# EAGLE design ARDUINO (EAGLE 9.6.2)
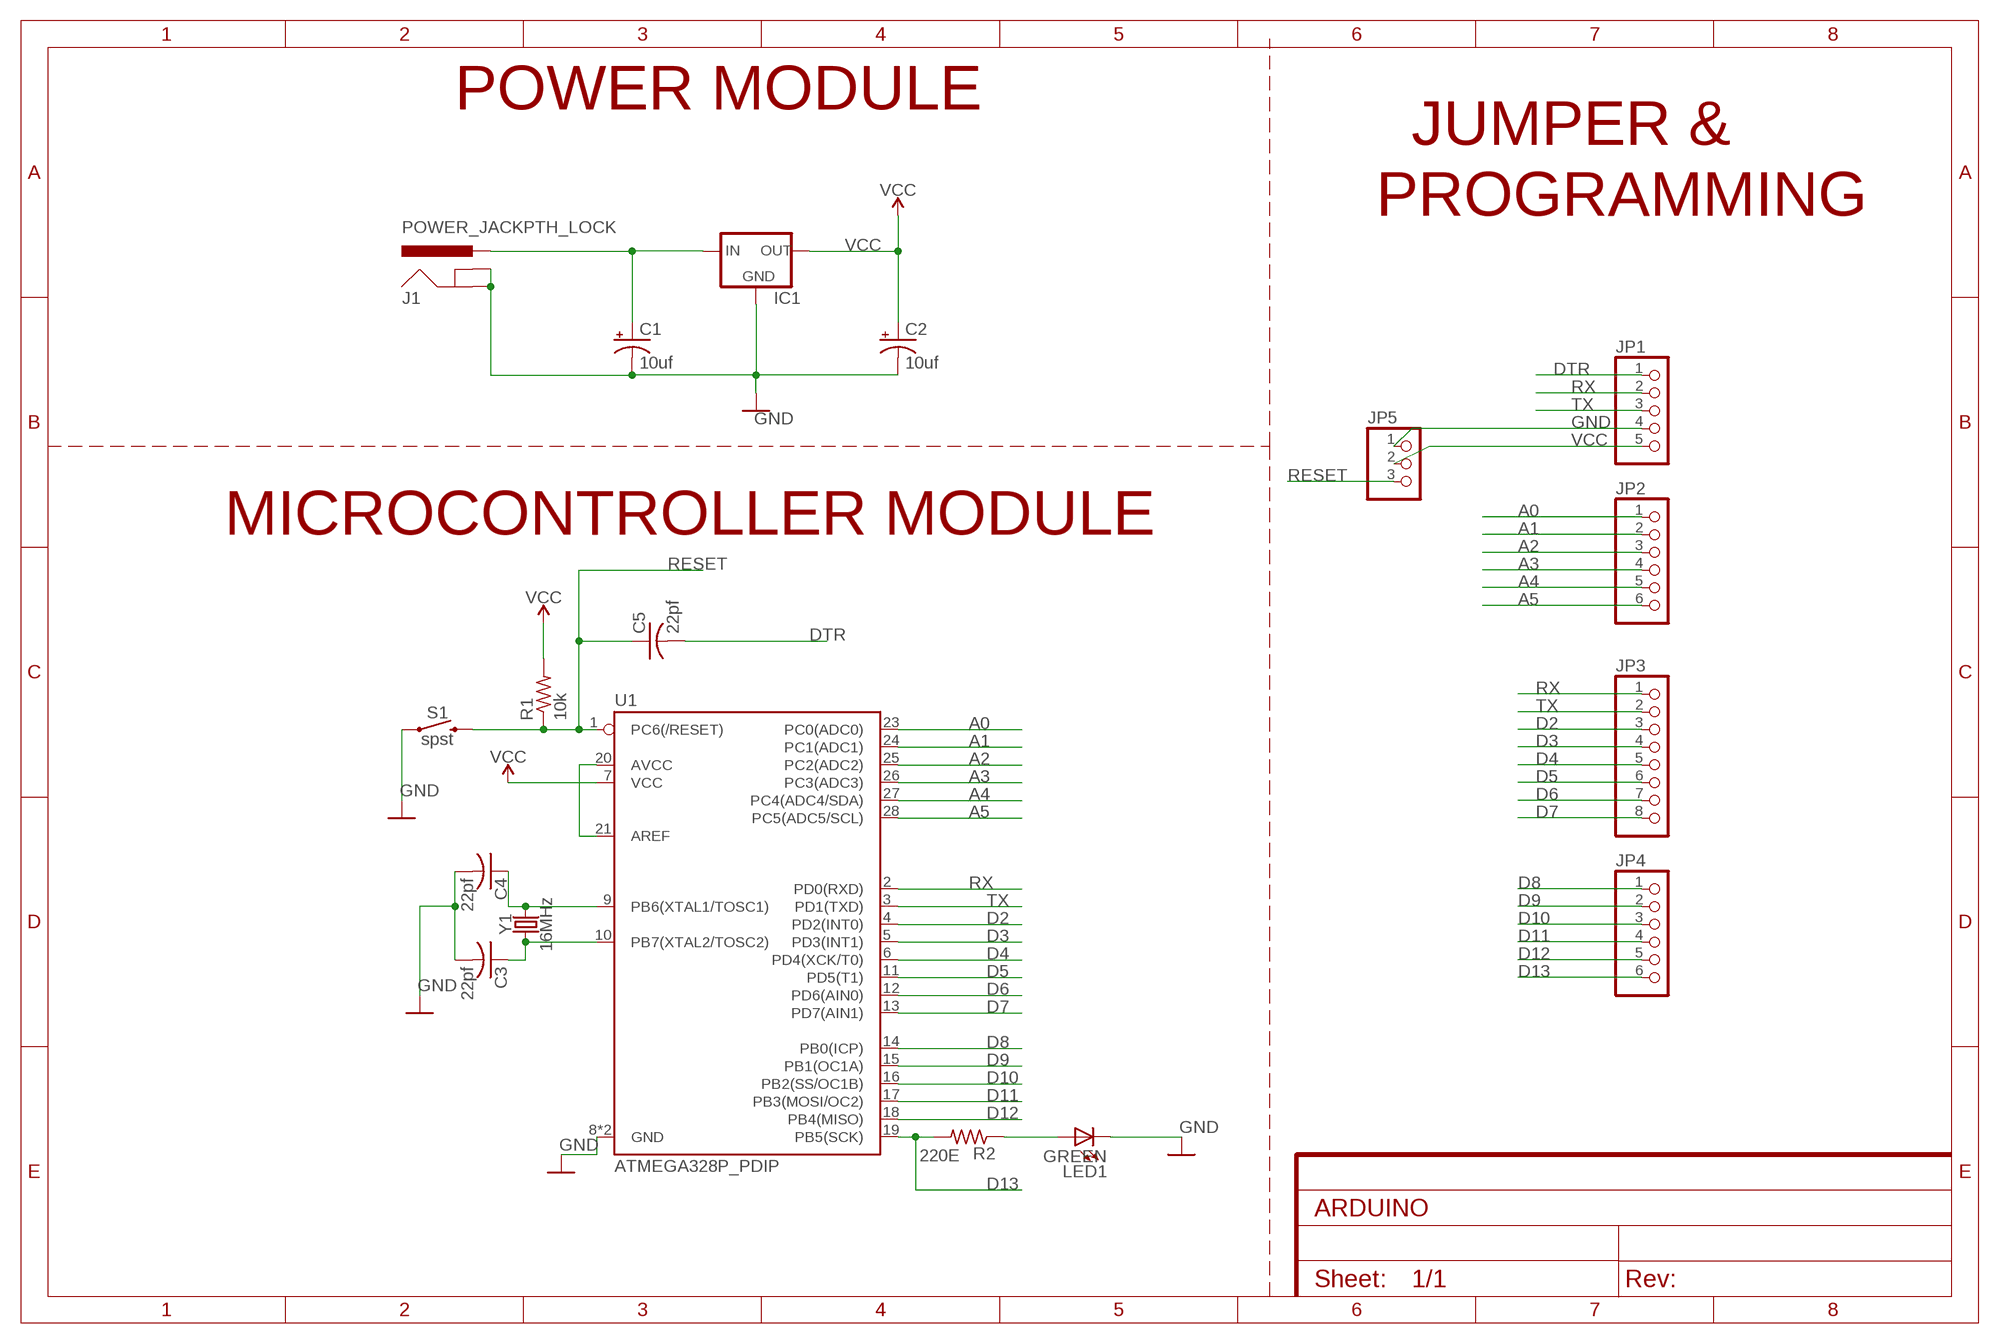
[diagram p0: schematic, sheet 1]

## Parts
C1  10uf  CPOL-USE2,5-6E  [E2,5-6E]
C2  10uf  CPOL-USE2,5-6E  [E2,5-6E]
C3  22pf  C-US025-024X044  [C025-024X044]
C4  22pf  C-US025-024X044  [C025-024X044]
C5  22pf  C-US025-024X044  [C025-024X044]
IC1  MCP1700TRI  [TO92]
J1  POWER_JACKPTH_LOCK  [POWER_JACK_PTH_LOCK]
JP1  PINHD-1X5  [1X05]
JP2  PINHD-1X6  [1X06]
JP3  PINHD-1X8  [1X08]
JP4  PINHD-1X6  [1X06]
JP5  PINHD-1X3  [1X03]
LED1  GREEN  LED3MM  [LED3MM]
R1  10k  R-US_0204/7  [0204/7]
R2  220E  R-US_0204/7  [0204/7]
S1  spst  MOMENTARY-SWITCH-SPST-PTH-6.0MM  [TACTILE_SWITCH_PTH_6.0MM]
U1  ATMEGA328P_PDIP  [DIP28]
Y1  16MHz  CRYSTAL-16MHZPTH-HC49US  [HC49US]

## Nets
A0: JP2.1 U1.23(PC0(ADC0))
A1: JP2.2 U1.24(PC1(ADC1))
A2: JP2.3 U1.25(PC2(ADC2))
A3: JP2.4 U1.26(PC3(ADC3))
A4: JP2.5 U1.27(PC4(ADC4/SDA))
A5: JP2.6 U1.28(PC5(ADC5/SCL))
D2: JP3.3 U1.4(PD2(INT0))
D3: JP3.4 U1.5(PD3(INT1))
D4: JP3.5 U1.6(PD4(XCK/T0))
D5: JP3.6 U1.11(PD5(T1))
D6: JP3.7 U1.12(PD6(AIN0))
D7: JP3.8 U1.13(PD7(AIN1))
D8: JP4.1 U1.14(PB0(ICP))
D9: JP4.2 U1.15(PB1(OC1A))
D10: JP4.3 U1.16(PB2(SS/OC1B))
D11: JP4.4 U1.17(PB3(MOSI/OC2))
D12: JP4.5 U1.18(PB4(MISO))
D13: JP4.6 R2.2 U1.19(PB5(SCK))
DTR: C5.2 JP1.1
GND: C1.- C2.- C3.2 C4.2 IC1.1(GND) J1.GND J1.GNDBREAK JP1.4 JP5.1 LED1.K(C) S1.1 U1.8(GND) U1.22(GND)
N$1: C1.+ IC1.2(IN) J1.PWR
N$2: C4.1 U1.9(PB6(XTAL1/TOSC1)) Y1.2
N$3: C3.1 U1.10(PB7(XTAL2/TOSC2)) Y1.1
N$6: U1.20(AVCC) U1.21(AREF)
N$7: LED1.A R2.1
RESET: C5.1 JP5.3 R1.1 S1.3 U1.1(PC6(/RESET))
RX: JP1.2 JP3.1 U1.2(PD0(RXD))
TX: JP1.3 JP3.2 U1.3(PD1(TXD))
VCC: C2.+ IC1.3(OUT) JP1.5 JP5.2 R1.2 U1.7(VCC)

## Notes on the sheet
- POWER MODULE
- JUMPER &
- PROGRAMMING
- MICROCONTROLLER MODULE

## Library data of the parts
C1 C2 = rcl:CPOL-US: POLARIZED CAPACITOR, American symbol; SPICEPREFIX: C
C3-C5 = rcl:C-US: CAPACITOR, American symbol; SPICEPREFIX: C
IC1 = adafruit:MCP1700: VOLTAGE REGULATOR
J1 = SparkFun-Connectors:POWER_JACK: Power Jack Connector This is the standard 5.5mm barrel jack for power. The PTH is the most common, proven, reliable, footprint. The Slot footprint only works if the mill layer is transmitted to the PCB fab house so be warned. Here are the connectors we sell at SparkFun: DC Barrel Power Jack/Connector <https://www.sparkfun.com/products/119> (PRT-00119) DC Barrel Power Jack/Connector (SMD) <https://www.sparkfun.com/products/12748> (PRT-12748) DC Barrel Jack Adapter - Breadboard Compatible <https://www.sparkfun.com/products/10811> (PRT-10811) It is used on this SparkFun product (and many, many others): SparkFun RedBoard - Programmed with Arduino <https://www.sparkfun.com/products/12757> (DEV-12757) Also, if you need a mating power supply or connector, please check these out: Wall Adapter Power Supply - 9VDC 650mA <https://www.sparkfun.com/products/298> (TOL-00298) DC Barrel Jack Adapter - Male <https://www.sparkfun.com/products/10287> (PRT-10287); PROD_ID: CONN-08197; SF_ID: PRT-00119
JP1 = pinhead:PINHD-1X5: PIN HEADER
JP2 JP4 = pinhead:PINHD-1X6: PIN HEADER
JP3 = pinhead:PINHD-1X8: PIN HEADER
JP5 = pinhead:PINHD-1X3: PIN HEADER
LED1 = adafruit:LED: LED OSRAM: - CHIPLED LG R971, LG N971, LY N971, LG Q971, LY Q971, LO R971, LY R971 LH N974, LH R974 LS Q976, LO Q976, LY Q976 LO Q996 - Hyper CHIPLED LW Q18S LB Q993, LB Q99A, LB R99A - SideLED LS A670, LO A670, LY A670, LG A670, LP A670 LB A673, LV A673, LT A673, LW A673 LH A674 LY A675 LS A676, LA A676, LO A676, LY A676, LW A676 LS A679, LY A679, LG A679 - Hyper Micro SIDELED® LS Y876, LA Y876, LO Y876, LY Y876 LT Y87S - SmartLED LW L88C, LW L88S LB L89C, LB L89S, LG L890 LS L89K, LO L89K, LY L89K LS L896, LA L896, LO L896, LY L896 - TOPLED LS T670, LO T670, LY T670, LG T670, LP T670 LSG T670, LSP T670, LSY T670, LOP T670, LYG T670 LG T671, LOG T671, LSG T671 LB T673, LV T673, LT T673, LW T673 LH T674 LS T676, LA T676, LO T676, LY T676, LB T676, LH T676, LSB T676, LW T676 LB T67C, LV T67C, LT T67C, LS T67K, LO T67K, LY T67K, LW E67C LS E67B, LA E67B, LO E67B, LY E67B, LB E67C, LV E67C, LT E67C LW T67C LS T679, LY T679, LG T679 LS T770, LO T770, LY T770, LG T770, LP T770 LB T773, LV T773, LT T773, LW T773 LH T774 LS E675, LA E675, LY E675, LS T675 LS T776, LA T776, LO T776, LY T776, LB T776 LHGB T686 LT T68C, LB T68C - Hyper Mini TOPLED® LB M676 - Mini TOPLED Santana® LG M470 LS M47K, LO M47K, LY M47K Source: http://www.osram.convergy.de/
R1 R2 = rcl:R-US_: RESISTOR, American symbol; SPICEPREFIX: R
S1 = SparkFun-Switches:MOMENTARY-SWITCH-SPST: Momentary Switch (Pushbutton) - SPST Normally-open (NO) SPST momentary switches (buttons, pushbuttons). Variants PTH-12MM - 12mm square, through-hole Momentary Pushbutton Switch - 12mm Square <https://www.sparkfun.com/products/9190> (COM-09190) PTH-6.0MM, PTH-6.0MM-KIT - 6.0mm square, through-hole Mini Pushbutton Switch <https://www.sparkfun.com/products/97> (COM-00097) KIT package intended for soldering kit's - only one side of pads' copper is exposed. PTH-RIGHT-ANGLE-KIT - Right-angle, through-hole Right Angle Tactile Button <https://www.sparkfun.com/products/10791> - Used on SparkFun BigTime Watch Kit <https://www.sparkfun.com/products/11734> SMD-12MM - 12mm square, surface-mount Tactile Button - SMD (12mm) <https://www.sparkfun.com/products/12993> (COM-12993) Used on SparkFun PicoBoard <https://www.sparkfun.com/products/11888> SMD-4.5MM - 4.5mm Square Trackball Switch Used on SparkFun Blackberry Trackballer Breakout <https://www.sparkfun.com/products/13169> SMD-4.6MMX2.8MM - 4.60mm x 2.80mm, surface mount Used on SparkFun Pro Micro - RP2040 <https://www.sparkfun.com/products/17717> SMD-5.2MM, SMD-5.2-REDUNDANT - 5.2mm square, surface-mount Mini Pushbutton Switch - SMD <https://www.sparkfun.com/products/8720> (COM-08720) Used on Arduino Pro Mini <https://www.sparkfun.com/products/11114> REDUNDANT package connects both switch circuits together SMD-6.0X3.5MM - 6.0 x 3.5mm, surface mount Momentary Reset Switch SMD <https://www.sparkfun.com/products/8229> (COM-08229) SMD-6.2MM-TALL - 6.2mm square, surface mount Tactile Button - SMD (6mm) <https://www.sparkfun.com/products/12992> Used on SparkFun Digital Sandbox <https://www.sparkfun.com/products/12651> SMD-RIGHT-ANGLE - Right-angle, surface mount Used on SparkFun Block for Intel® Edison - Arduino <https://www.sparkfun.com/products/13036>; PROD_ID: SWCH-08441; SF_SKU: COM-00097
U1 = SparkFun-IC-Microcontroller:ATMEGA328P_PDIP: Atmel 328P Through hole ATMEGA328P uC used in the Arduino 32kb flash, 1k EEPROM, 2k SRAM Datasheet <http://www.sparkfun.com/datasheets/Components/SMD/ATMega328.pdf> SparkFun Products Storefront component: AVR 28 Pin 20MHz 32K 6A/D - ATMega328P <https://www.sparkfun.com/products/9061> (COM-09061) SparkFun Simon Says - Through-Hole Soldering Kit <https://www.sparkfun.com/products/10547> (KIT-10547) SparkFun Learn to Solder - Simon Says <https://www.sparkfun.com/products/13708> (KIT-13708) SparkFun BigTime Watch Kit <https://www.sparkfun.com/products/11734> (KIT-11734) SparkFun ClockIt <https://www.sparkfun.com/products/10930> (KIT-10930) SparkFun Serial Enabled LCD Kit <https://www.sparkfun.com/products/10097> (LCD-10097) SparkFun Simon Tilts - Through Hole Soldering Kit <https://www.sparkfun.com/products/12634> (KIT-12634) SparkFun Frequency Counter Kit <https://www.sparkfun.com/products/10140> (KIT-10140) FabFM Radio Kit <https://www.sparkfun.com/products/11043> (KIT-11043) SparkFun Binary Blaster Kit <https://www.sparkfun.com/products/12037> (KIT-12037) SparkFun Metro-Gnome <https://www.sparkfun.com/products/9236> (KIT-09236) ATmega328 with Arduino Optiboot (Uno) <https://www.sparkfun.com/products/10524> (DEV-10524); PROD_ID: IC-09136; VALUE: 328P
Y1 = SparkFun-Clocks:CRYSTAL-16MHZ: 16MHz Crystal Digikey Example <http://www.digikey.com/product-search/en?keywords=535-9122-1-ND> Frequency: 16MHz Frequency Stability: ±50ppm Frequency Tolerance: ±20ppm Load Capacitance: 18pF SparkFun Products: Pro Micro -5V/16MHz <https://www.sparkfun.com/products/12640> SparkFun Serial Enabled LCD Kit <https://www.sparkfun.com/products/10097>; PROD_ID: XTAL-08181; SF_ID: COM-00536

## Board
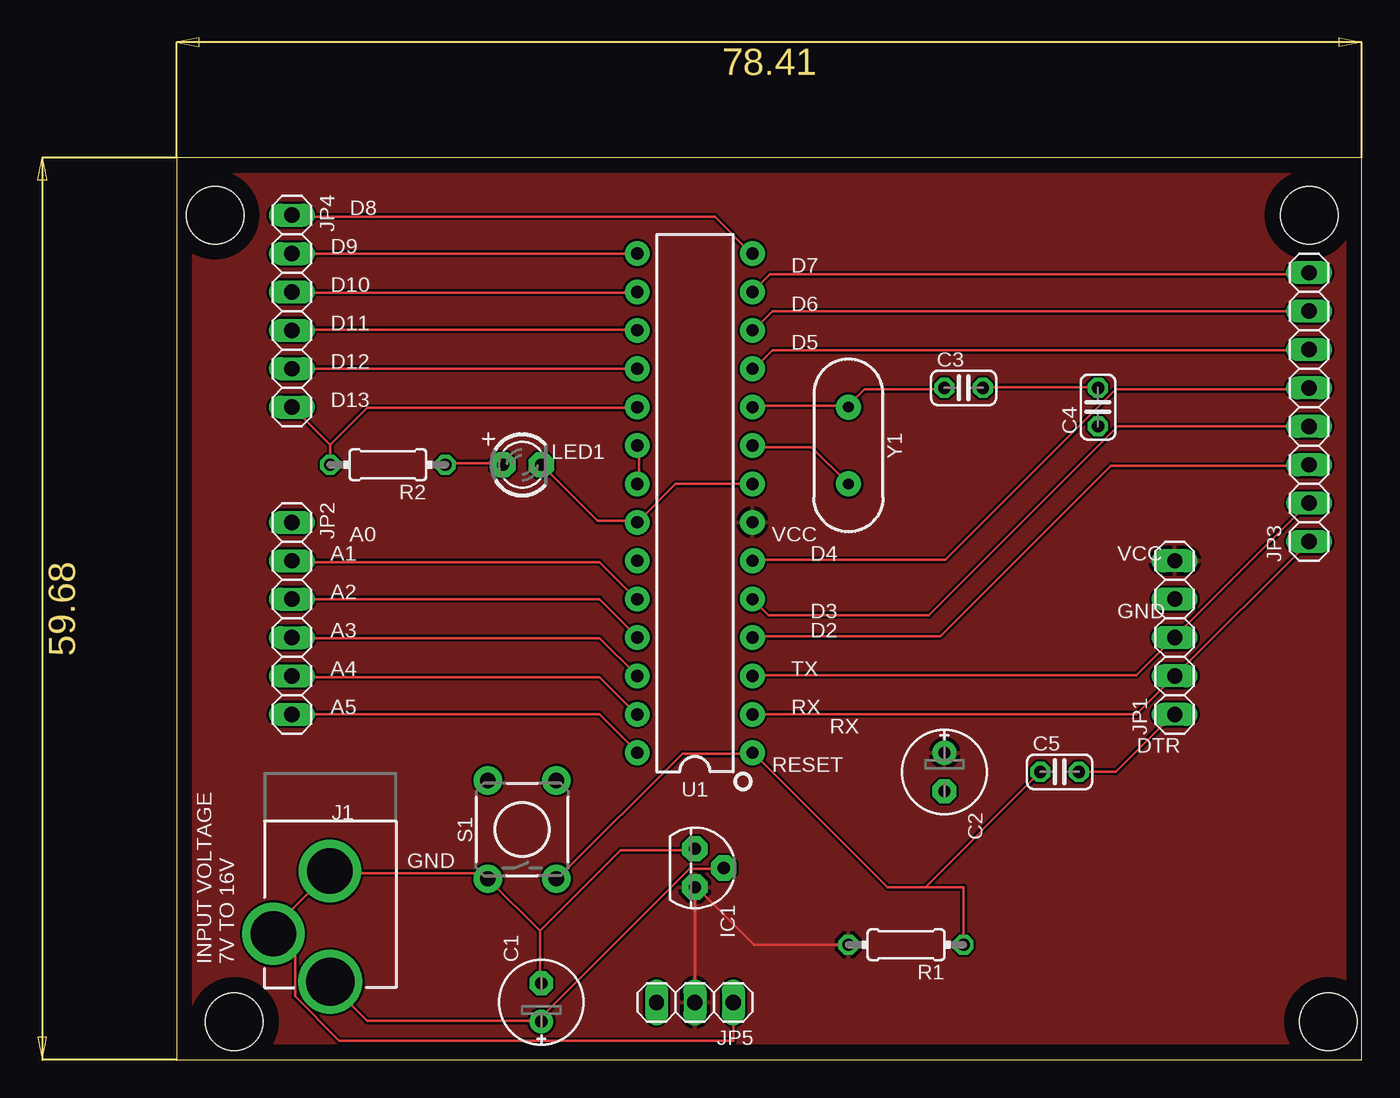
[diagram p1: board, top side]
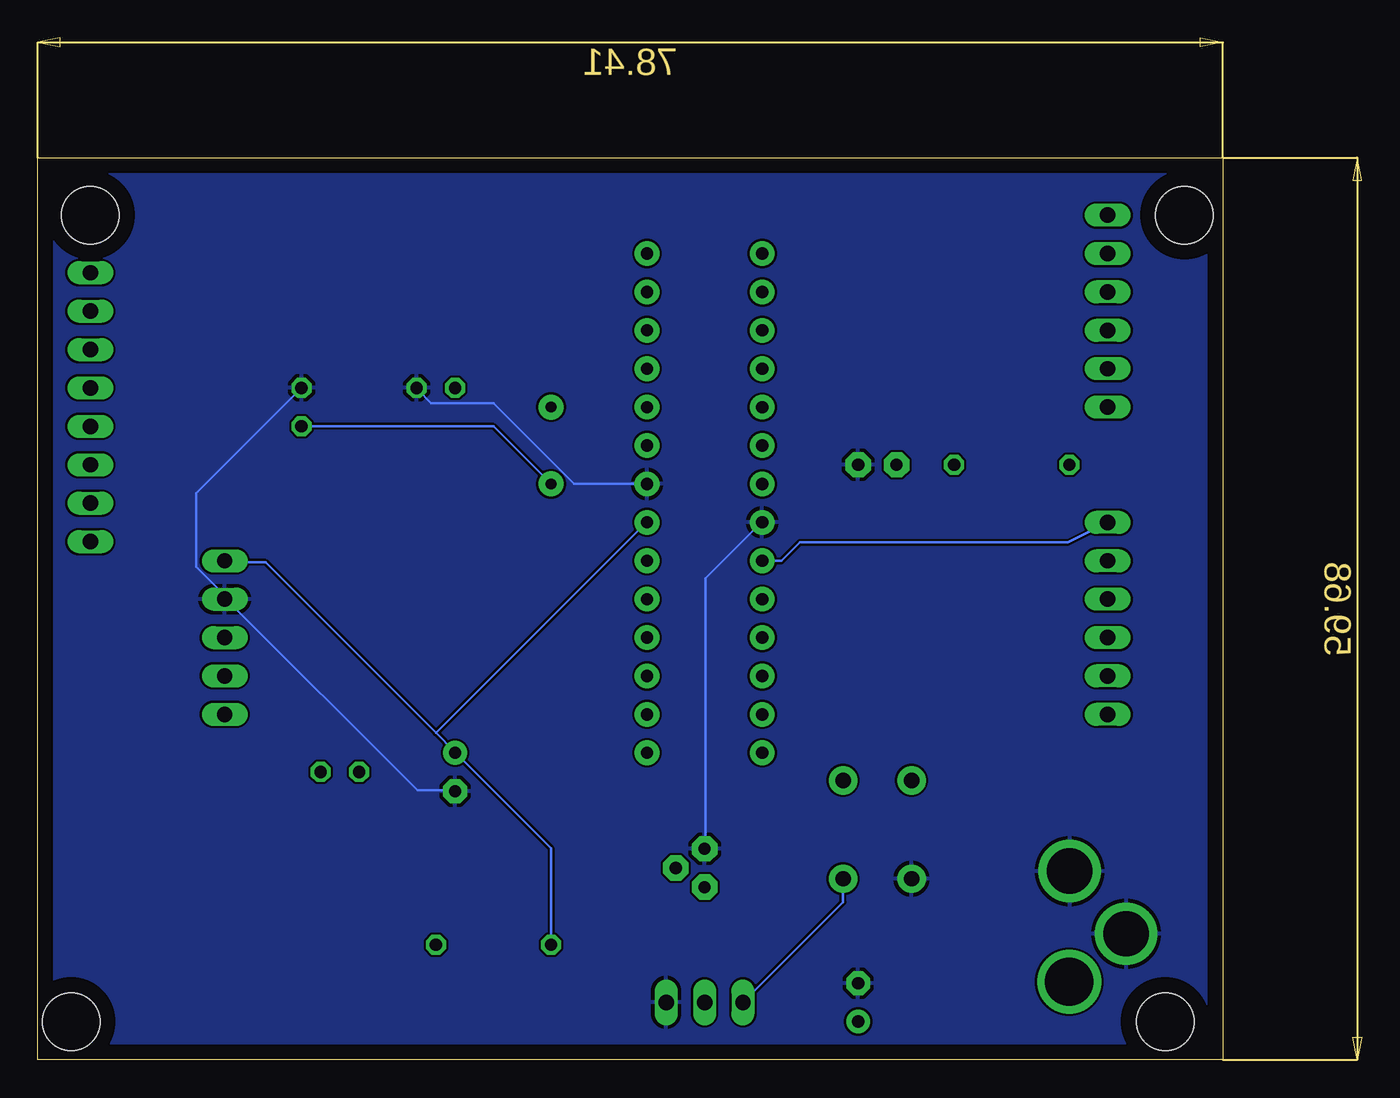
[diagram p2: board, bottom side, seen from below]

Size 78.41 x 59.68 mm. Coordinates in mm from the lower left corner, seen from the top.
Outline: 0,0 78.41,0 78.41,59.68 0,59.68 0,0
Copper layers (1*16): Top 0.035mm / dielectric 1.5mm / Bottom 0.035mm
Design rules "default": minimum track width 6mil, minimum drill 0.35mm, track to track 6mil, track to pad 6mil, pad to pad 6mil, via to via 6mil, smd to smd 6mil, copper to edge 40mil, drill to drill 6mil, minimum pad ring 10mil, minimum via ring 8mil, stop-mask expansion 4mil, vias tented up to drill 0mil, thermal gap 10mil
Holes 3.81 mm at 2.54,55.88 74.93,55.88 76.2,2.54 3.81,2.54

### Footprints (pad centres in the part's own frame; a part is rotated, then mirrored left to right if it is on the bottom)
E2,5-6E = drill 0.813 pad 1.575: + -1.27,0 | drill 0.813 pad 1.575 octagon: - 1.27,0
C025-024X044 = drill 0.813 octagon: 1 -1.27,0; 2 1.27,0
TO92 = drill 0.813 pad 1.676 octagon: 1 -1.27,0; 2 0,1.905; 3 1.27,0
POWER_JACK_PTH_LOCK = drill 2.997 pad 4.115: GND 0.025,6.557; GNDBREAK 3.762,10.7 | drill 3.2 pad 4.115: PWR 0,13.878
1X05 = drill 1.016 long: 1 -5.08,0; 2 -2.54,0; 3 0,0; 4 2.54,0; 5 5.08,0
1X06 = drill 1.016 long: 1 -6.35,0; 2 -3.81,0; 3 -1.27,0; 4 1.27,0; 5 3.81,0; 6 6.35,0
1X08 = drill 1.016 long: 1 -8.89,0; 2 -6.35,0; 3 -3.81,0; 4 -1.27,0; 5 1.27,0; 6 3.81,0; 7 6.35,0; 8 8.89,0
1X03 = drill 1.016 long: 1 -2.54,0; 2 0,0; 3 2.54,0
LED3MM = drill 0.813 pad 1.676 octagon: A -1.27,0; K 1.27,0
0204/7 = drill 0.813 octagon: 1 -3.81,0; 2 3.81,0
TACTILE_SWITCH_PTH_6.0MM = drill 1.016 pad 1.88: 1 -3.251,2.261; 2 3.251,2.261; 3 -3.251,-2.261; 4 3.251,-2.261
DIP28 = drill 0.813 pad 1.626: 1 -16.51,-3.81; 2 -13.97,-3.81; 3 -11.43,-3.81; 4 -8.89,-3.81; 5 -6.35,-3.81; 6 -3.81,-3.81; 7 -1.27,-3.81; 8 1.27,-3.81; 9 3.81,-3.81; 10 6.35,-3.81; 11 8.89,-3.81; 12 11.43,-3.81; 13 13.97,-3.81; 14 16.51,-3.81; 15 16.51,3.81; 16 13.97,3.81; 17 11.43,3.81; 18 8.89,3.81; 19 6.35,3.81; 20 3.81,3.81; 21 1.27,3.81; 22 -1.27,3.81; 23 -3.81,3.81; 24 -6.35,3.81; 25 -8.89,3.81; 26 -11.43,3.81; 27 -13.97,3.81; 28 -16.51,3.81
HC49US = drill 0.7 pad 1.651: 1 -2.54,0; 2 2.54,0

### Placement (x,y rotation side)
C1  24.13,3.81 90 top
C2  50.8,19.05 270 top
C3  52.07,44.45 0 top
C4  60.96,43.18 90 top
C5  58.42,19.05 0 top
IC1  34.29,12.7 270 top
J1  10.16,19.05 180 top
JP1  66.04,27.94 90 top
JP2  7.62,29.21 270 top
JP3  74.93,43.18 90 top
JP4  7.62,49.53 270 top
JP5  34.29,3.81 180 top
LED1  22.86,39.37 0 top
R1  48.26,7.62 180 top
R2  13.97,39.37 180 top
S1  22.86,15.24 90 top
U1  34.29,36.83 90 top
Y1  44.45,40.64 270 top

### Tracks (layer width: path | path; a pad name or v marks a point on that pad's centre or on a via)
A0
  Bottom 0.152: U1.23 29.21,33.02 27.99,34.24 10.26,34.24 JP2.1
A1
  Top 0.152: JP2.2 7.72,32.92 27.99,32.92 30.43,30.48 U1.24
A2
  Top 0.152: JP2.3 27.99,30.48 30.43,28.04 U1.25
A3
  Top 0.152: U1.26 27.99,27.89 7.72,27.89 JP2.4
A4
  Top 0.152: JP2.5 7.72,25.3 27.99,25.3 30.43,22.86 U1.27
A5
  Top 0.152: JP2.6 27.99,22.86 30.43,20.42 U1.28
D2
  Top 0.152: JP3.3 74.93,39.32 61.82,39.32 50.55,28.04 38.2,28.04 U1.4
D3
  Top 0.152: JP3.4 62.28,41.91 49.78,29.41 39.17,29.41 U1.5
D4
  Top 0.152: JP3.5 74.93,44.35 62.13,44.35 50.85,33.07 38.2,33.07 U1.6
D5
  Top 0.152: JP3.6 74.93,46.94 39.42,46.94 38.2,45.72 U1.11
D6
  Top 0.152: JP3.7 39.42,49.53 38.2,48.31 U1.12
D7
  Top 0.152: U1.13 39.27,51.97 74.93,51.97 JP3.8
D8
  Top 0.152: JP4.1 7.72,55.78 35.61,55.78 38.05,53.34 U1.14
D9
  Top 0.152: U1.15 JP4.2
D10
  Top 0.152: JP4.3 7.72,50.75 30.43,50.75 U1.16
D11
  Top 0.152: JP4.4 7.72,48.31 30.43,48.31 U1.17
D12
  Top 0.152: U1.18 JP4.5
D13
  Top 0.152: 10.16,40.69 R2.2 | 10.16,40.69 7.72,43.13 JP4.6 | 10.16,40.69 12.6,43.13 30.43,43.13 U1.19
DTR
  Top 0.152: C5.2 62.13,19.05 65.94,22.86 JP1.1
GND
  Top 0.152: 24.03,8.53 24.03,5.18 C1.- | 24.03,8.53 20.68,11.89 S1.1 20.52,12.04 20.22,12.34 10.16,12.34 J1.GND 10.01,12.34 6.5,8.84 6.5,8.38 J1.GNDBREAK 7.82,6.92 7.82,4.2 10.76,1.27 36.83,1.27 JP5.1 | 24.03,8.53 29.36,13.87 34.24,13.87 IC1.1 | LED1.K 27.84,35.66 30.43,35.66 U1.22 33.02,38.1 U1.8 | C3.2 53.44,44.5 60.91,44.5 C4.2
  Bottom 0.152: C4.2 67.92,37.49 67.92,32.61 66.09,30.78 66.09,30.48 JP1.4 65.94,30.48 53.29,17.83 50.85,17.83 C2.- | U1.8 42.93,38.1 48.26,43.43 52.38,43.43 53.29,44.35 C3.2 | IC1.1 34.24,14.02 34.24,31.85 30.58,35.51 U1.22
  pour Bottom: 1.27,63.5 83.82,63.5 83.82,-6.35 82.55,-7.62 -3.81,-7.62 -3.81,63.5
N$1
  Top 0.152: 23.88,2.59 12.6,2.59 10.16,5.03 J1.PWR | 23.88,2.59 24.03,2.59 C1.+ 23.88,2.59 | 23.88,2.59 33.93,12.65 36.07,12.65 IC1.2
N$2
  Top 0.152: Y1.2 42.01,40.54 38.2,40.54 U1.9
  Bottom 0.152: C4.1 48.26,41.91 Y1.2
N$3
  Top 0.152: 44.45,43.28 45.52,44.35 50.7,44.35 C3.1 | 44.45,43.28 38.2,43.28 U1.10 | 44.45,43.28 Y1.1
N$6
  Top 0.152: U1.21 30.58,38.1 30.58,40.54 U1.20
N$7
  Top 0.152: R2.1 17.78,39.47 21.59,39.47 LED1.A
RESET
  Top 0.152: R1.1 52.07,11.43 49.53,11.43 | C5.1 49.53,11.43 | S1.3 25.25,12.04 33.48,20.27 38.05,20.27 U1.1 38.2,20.27 47.04,11.43 49.53,11.43
  Bottom 0.152: JP5.3 25.12,10.44 S1.3
RX
  Top 0.152: JP3.1 JP1.2 63.5,22.86 U1.2
TX
  Top 0.152: JP3.2 74.93,36.88 66.09,28.04 JP1.3 65.94,27.89 63.5,25.45 38.2,25.45 U1.3
VCC
  Top 0.152: R1.2 38.2,7.62 34.39,11.43 | 34.39,11.43 IC1.3 | JP5.2 34.29,11.33 34.39,11.43
  Bottom 0.152: 52.07,21.64 50.85,20.42 C2.+ 50.7,20.27 44.45,14.02 R1.2 | 52.07,21.64 63.35,32.92 65.94,32.92 JP1.5 | 52.07,21.64 38.2,35.51 U1.7
  pour Top: -1.27,60.96 81.28,60.96 81.28,-1.27 -1.27,-1.27

### Text on the board
tPlace: D8 | D9 | D7 | D10 | D6 | D11 | D5 | D12 | D13 | A0 | VCC | A1 | D4 | VCC | A2 | D3 | GND | A3 | D2 | A4 | TX | A5 | RX | RX | DTR | RESET | GND | INPUT VOLTAGE / 7V TO 16V
Beschreib: ARDUINO BOARD